# EAGLE design high_power_motorshield_v1 (EAGLE 6.5.0)
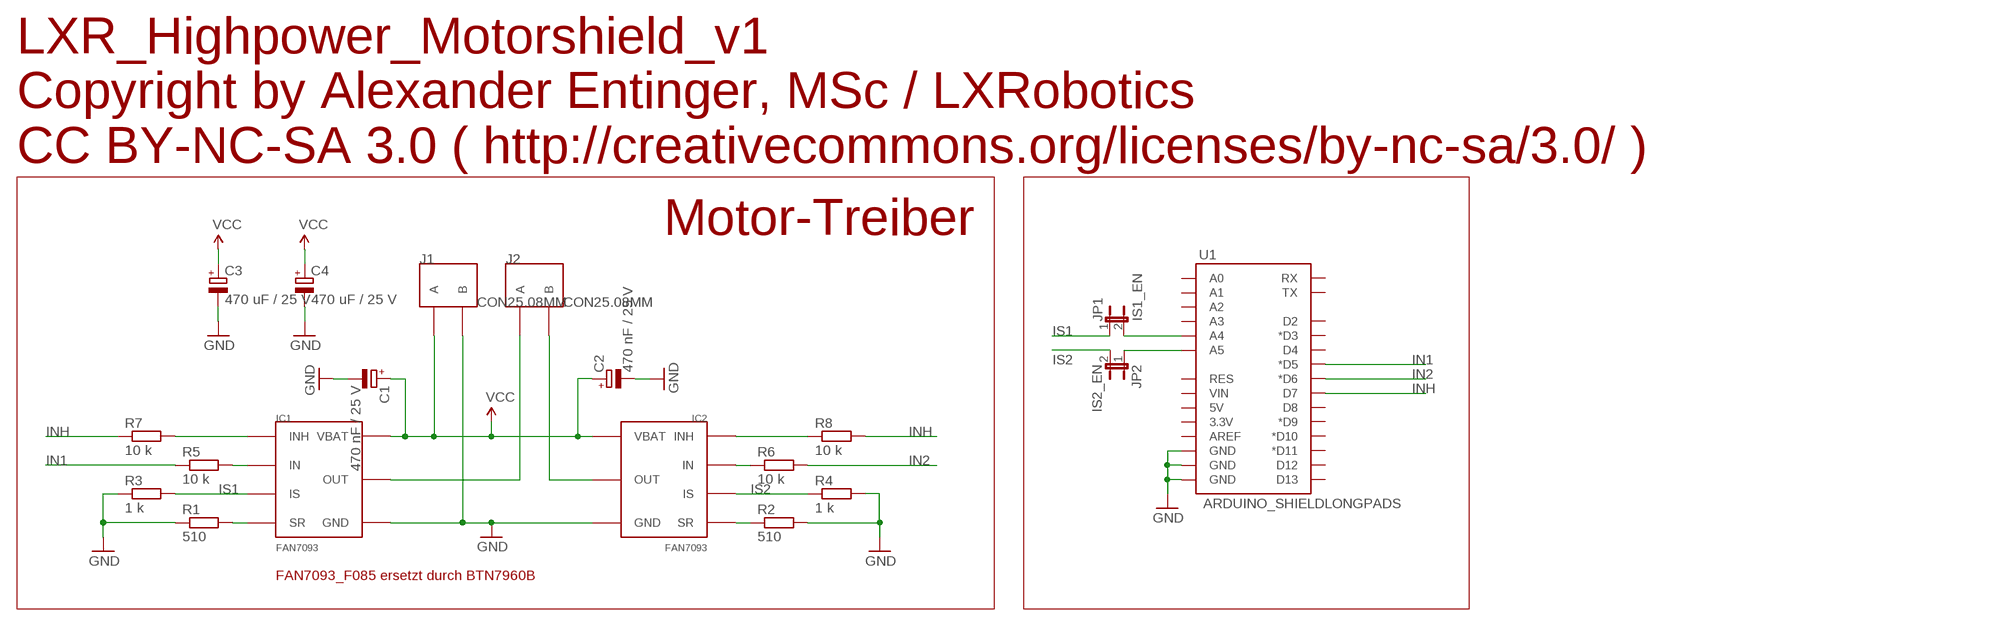
[diagram p0: schematic, sheet 1]

## Parts
C1  470 nF / 25 V  CPOL-EU  [KEMET_A]
C2  470 nF / 25 V  CPOL-EU  [KEMET_A]
C3  470 uF / 25 V  CPOL-EUE5-10.5  [E5-10,5]
C4  470 uF / 25 V  CPOL-EUE5-10.5  [E5-10,5]
IC1  FAN7093  [TO263-7L]
IC2  FAN7093  [TO263-7L]
J1  CON25.08MM  [CON2_SCHRAUBKLEMME]
J2  CON25.08MM  [CON2_SCHRAUBKLEMME]
JP1  IS1_EN  JP1E  [JP1]
JP2  IS2_EN  JP1E  [JP1]
R1  510  R-EU_R0805  [R0805]
R2  510  R-EU_R0805  [R0805]
R3  1 k  R-EU_R0805  [R0805]
R4  1 k  R-EU_R0805  [R0805]
R5  10 k  R-EU_R0805  [R0805]
R6  10 k  R-EU_R0805  [R0805]
R7  10 k  R-EU_R0805  [R0805]
R8  10 k  R-EU_R0805  [R0805]
U1  ARDUINO_SHIELDLONGPADS  [DUEMILANOVE_SHIELD_LONGPADS]

## Nets
GND: C1.CATHODE(-) C2.CATHODE(-) C3.- C4.- IC1.GND IC2.GND J1.2(B) R1.1 R2.2 R3.1 R4.2 U1.GND@0(GND) U1.GND@1(GND) U1.GND@2(GND)
IN1: R5.1 U1.D5(*D5)
IN2: R6.2 U1.D6(*D6)
INH: R7.1 R8.2 U1.D7
IS1: IC1.IS JP1.1 R3.2
IS2: IC2.IS JP2.2 R4.1
N$1: IC1.INH R7.2
N$2: IC1.IN R5.2
N$3: IC1.OUT IC1.OUT@1(OUT) J2.1(A)
N$4: IC2.OUT IC2.OUT@1(OUT) J2.2(B)
N$5: JP1.2 U1.A4
N$6: IC1.SR R1.2
N$7: IC2.SR R2.1
N$8: JP2.1 U1.A5
N$9: IC2.IN R6.1
N$10: IC2.INH R8.1
VCC: C1.ANODE(+) C2.ANODE(+) C3.+ C4.+ IC1.VBATT(VBAT) IC2.VBATT(VBAT) J1.1(A)
Unconnected: U1.3.3V U1.5V U1.A0 U1.A1 U1.A2 U1.A3 U1.AREF U1.D2 U1.D3(*D3) U1.D4 U1.D8 U1.D9(*D9) U1.D10(*D10) U1.D11(*D11) U1.D12 U1.D13 U1.RES U1.RX U1.TX U1.VIN

## Notes on the sheet
- LXR_Highpower_Motorshield_v1
  Copyright by Alexander Entinger, MSc / LXRobotics
  CC BY-NC-SA 3.0 ( http://creativecommons.org/licenses/by-nc-sa/3.0/ )
- Motor-Treiber
- FAN7093_F085 ersetzt durch BTN7960B

## Library data of the parts
C1-C4 = lxrobotics:CPOL-EU: POLARIZED CAPACITOR, European symbol
IC1 IC2 = lxrobotics:FAN7093
J1 J2 = lxrobotics:CON2
JP1 JP2 = jumper:JP1E: JUMPER
R1-R8 = resistor:R-EU_: RESISTOR, European symbol
U1 = SparkFun-Boards:ARDUINO_SHIELD: Arduino shield footprint

## Board
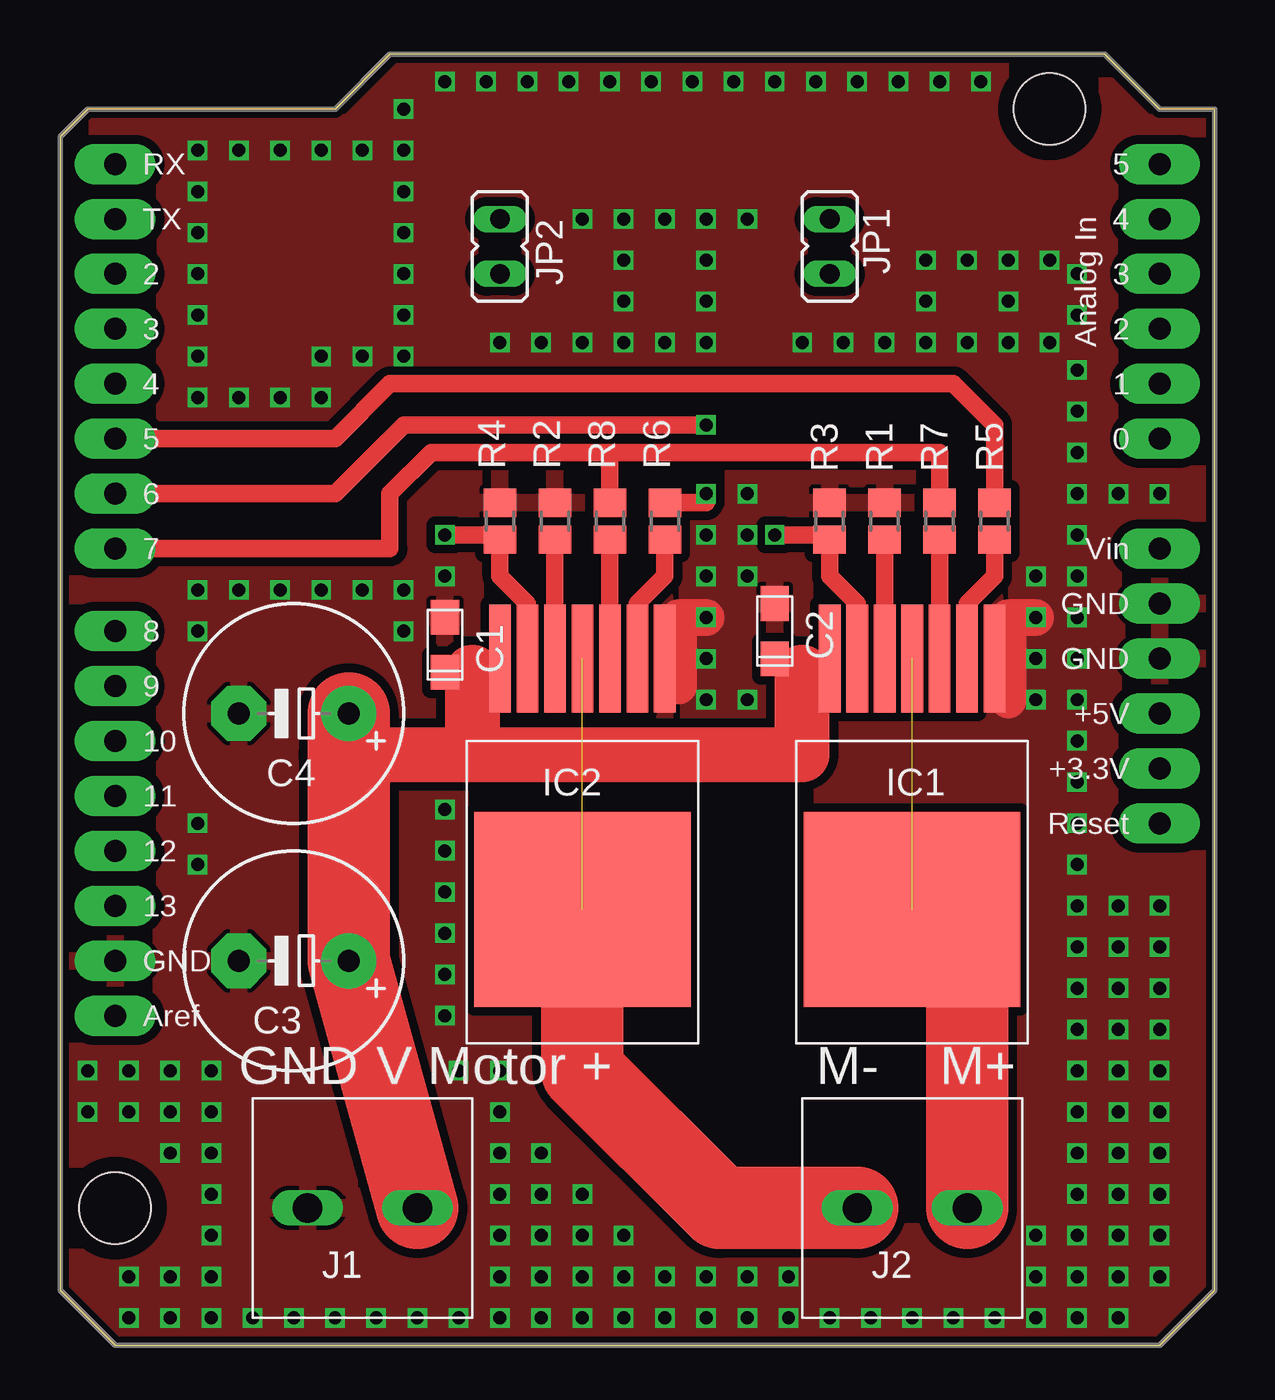
[diagram p1: board, top side]
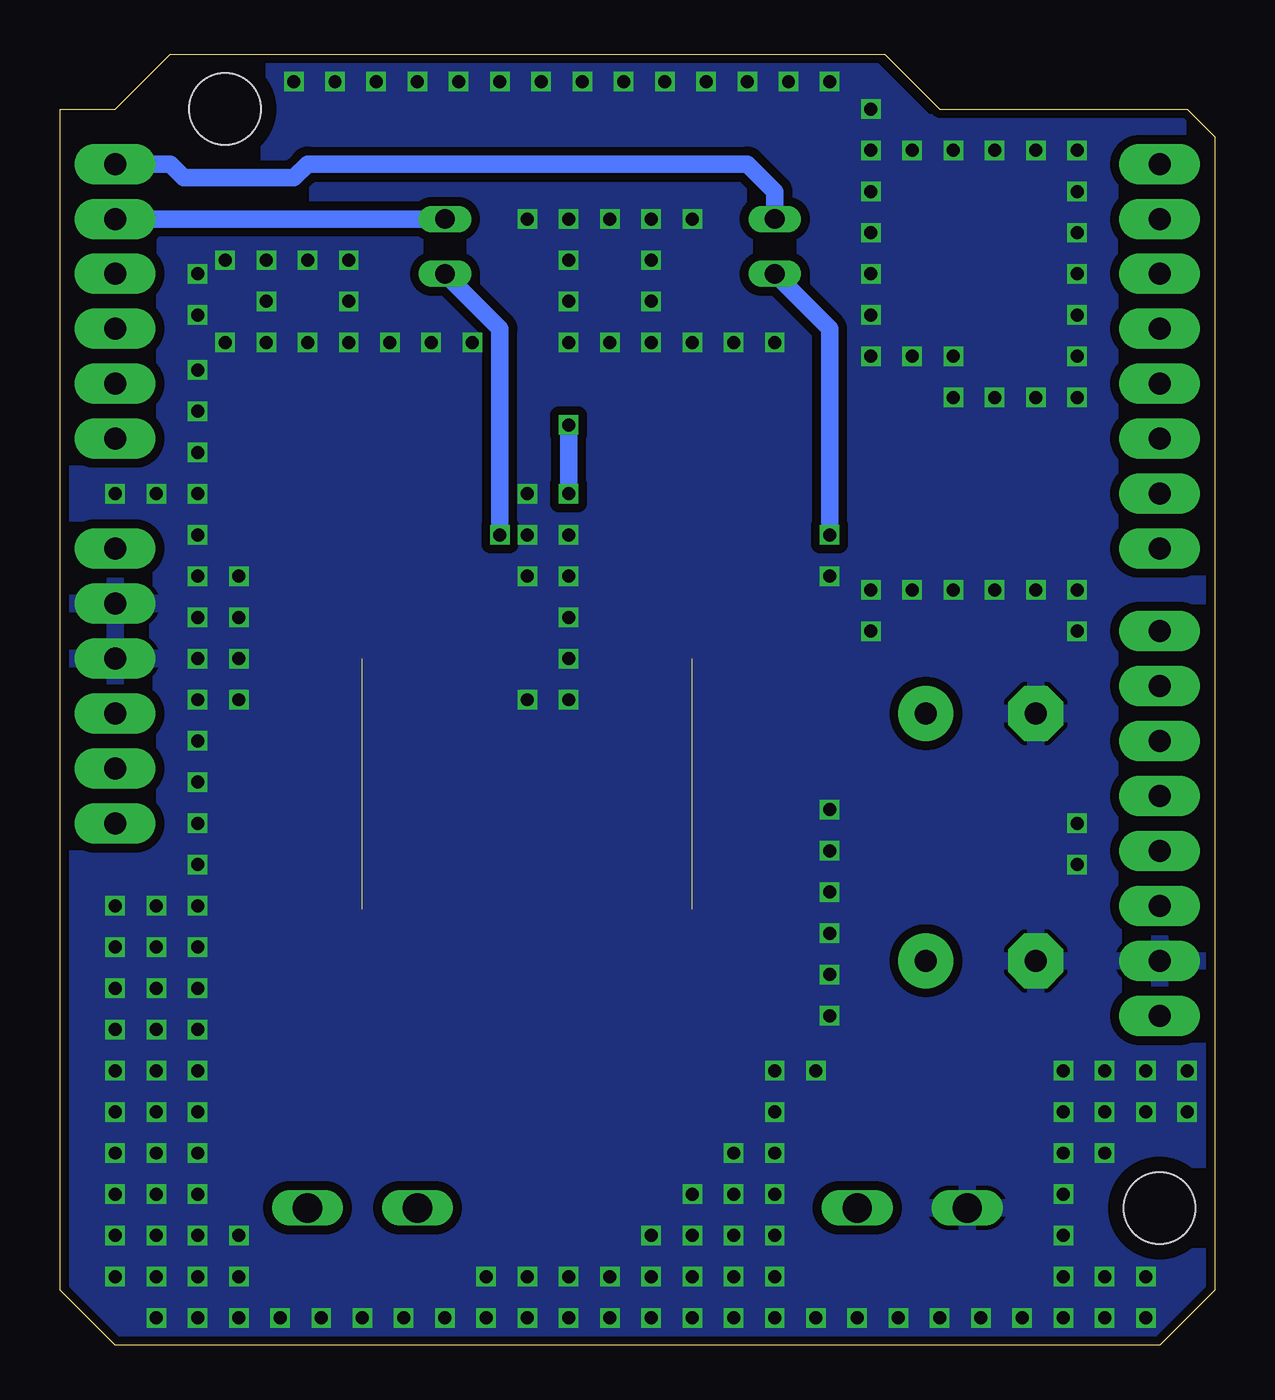
[diagram p2: board, bottom side, seen from below]

Size 53.34 x 59.69 mm. Coordinates in mm from the lower left corner, seen from the top.
Outline: 0,2.54 2.54,0 50.8,0 53.34,2.54 53.34,57.15 50.8,57.15 48.26,59.69 15.24,59.69 12.7,57.15 1.27,57.15 0,55.88 0,2.54
Copper layers (1*16): Top 0.035mm / dielectric 1.5mm / Bottom 0.035mm
Design rules "LeitOn - Standard-Eagle-DRU - 1- und  2-Lagen DK - deutsch - Rev 2.0": minimum track width 0.15mm, minimum drill 0.3mm, track to track 0.15mm, track to pad 0.15mm, pad to pad 0.15mm, via to via 0.15mm, smd to smd 0.15mm, copper to edge 0.3mm, drill to drill 0.3mm, minimum pad ring 0.15mm, minimum via ring 0.15mm, stop-mask expansion 0.075mm, vias tented up to drill 0mil, thermal gap 0.2mm

### Footprints (pad centres in the part's own frame; a part is rotated, then mirrored left to right if it is on the bottom)
KEMET_A = smd 1.6 x 1.3: ANODE 1.275,0; CATHODE -1.275,0
E5-10,5 = drill 1.016 pad 2.54: + -2.54,0 | drill 1.016 pad 2.54 octagon: - 2.54,0
TO263-7L = smd 1 x 5: GND -3.81,0; IN -2.54,0; INH -1.27,0; IS 2.54,0; OUT 0,0; SR 1.27,0; VBATT 3.81,0 | smd 10 x 9: OUT@1 0,11.6
CON2_SCHRAUBKLEMME = drill 1.35 long: 1 -2.54,0; 2 2.54,0
JP1 = drill 0.914 long: 1 0,-1.27; 2 0,1.27
R0805 = smd 1.3 x 1.5: 1 -0.85,0; 2 0.85,0
DUEMILANOVE_SHIELD_LONGPADS = drill 1.016 pad 1.88 long: 3.3V 50.8,26.67; 5V 50.8,29.21; A0 50.8,41.91; A1 50.8,44.45; A2 50.8,46.99; A3 50.8,49.53; A4 50.8,52.07; A5 50.8,54.61; AREF 2.54,15.24; D2 2.54,49.53; D3 2.54,46.99; D4 2.54,44.45; D5 2.54,41.91; D6 2.54,39.37; D7 2.54,36.83; D8 2.54,33.02; D9 2.54,30.48; D10 2.54,27.94; D11 2.54,25.4; D12 2.54,22.86; D13 2.54,20.32; GND@0 50.8,31.75; GND@1 50.8,34.29; GND@2 2.54,17.78; RES 50.8,24.13; RX 2.54,54.61; TX 2.54,52.07; VIN 50.8,36.83 | hole 3.302: 45.72,57.15; 2.54,6.35

### Placement (x,y rotation side)
C1  17.78,32.39 270 top
C2  33.02,33.02 270 top
C3  10.79,17.78 180 top
C4  10.79,29.21 180 top
IC1  39.37,31.75 180 top
IC2  24.13,31.75 180 top
J1  13.97,6.35 180 top
J2  39.37,6.35 180 top
JP1  35.56,50.8 0 top
JP2  20.32,50.8 180 top
R1  38.1,38.1 270 top
R2  22.86,38.1 90 top
R3  35.56,38.1 270 top
R4  20.32,38.1 90 top
R5  43.18,38.1 270 top
R6  27.94,38.1 90 top
R7  40.64,38.1 270 top
R8  25.4,38.1 90 top
U1  0,0 0 top

### Tracks (layer width: path | path; a pad name or v marks a point on that pad's centre or on a via)
GND  (via drill 0.6)
  Top 1.676: v29.84,33.66 28.58,33.66 28.58,30.48 | v45.09,33.66 43.81,33.66 43.81,29.85
  other vias: 31.75,39.37 31.75,37.47 46.99,41.28 31.75,35.56 29.84,37.47 29.84,35.56 29.84,31.75 29.84,29.85 31.75,29.85 45.09,31.75 45.09,29.85 46.99,27.94 46.99,29.85 46.99,31.75 46.99,33.66 46.99,35.56 46.99,37.47 46.99,39.37 45.09,35.56 6.35,34.92 8.26,34.92 6.35,33.02 10.16,34.92 12.06,34.92 13.97,34.92 15.87,34.92 15.87,33.02 17.78,35.56 48.9,39.37 50.8,39.37 46.99,26.04 46.99,24.13 46.99,22.22 50.8,20.32 48.9,20.32 46.99,20.32 46.99,18.41 48.9,18.41 50.8,18.41 46.99,16.51 48.9,16.51 50.8,16.51 50.8,14.61 48.9,14.61 46.99,14.61 50.8,12.7 48.9,12.7 46.99,12.7 50.8,10.8 48.9,8.89 48.9,10.8 46.99,10.8 46.99,8.89 50.8,8.89 50.8,6.98 48.9,6.98 46.99,6.98 46.99,5.08 48.9,5.08 50.8,5.08 50.8,3.18 48.9,3.18 46.99,3.18 46.99,1.27 48.9,1.27 45.09,5.08 1.27,12.7 3.17,12.7 5.08,12.7 6.98,12.7 1.27,10.8 3.17,10.8 5.08,10.8 6.98,10.8 6.98,8.89 5.08,8.89 6.98,6.98 6.98,5.08 3.17,3.18 5.08,3.18 6.98,3.18 18.41,12.7 20.32,12.7 20.32,10.8 20.32,8.89 22.23,8.89 20.32,6.98 22.23,6.98 24.13,6.98 20.32,5.08 22.23,5.08 24.13,5.08 26.04,5.08 20.32,3.18 22.23,3.18 24.13,3.18 26.04,3.18 27.94,3.18 29.84,3.18 31.75,3.18 33.66,3.18 3.17,1.27 5.08,1.27 6.98,1.27 8.89,1.27 10.79,1.27 12.7,1.27 14.6,1.27 16.51,1.27 18.41,1.27 20.32,1.27 22.23,1.27 24.13,1.27 26.04,1.27 27.94,1.27 29.84,1.27 31.75,1.27 33.66,1.27 35.56,1.27 37.47,1.27 39.37,1.27 41.27,1.27 43.18,1.27 45.09,1.27 45.09,3.18 6.35,24.13 6.35,22.22 17.78,24.77 17.78,22.86 17.78,20.96 17.78,19.05 17.78,17.14 17.78,15.24 42.55,58.42 40.64,58.42 38.73,58.42 36.83,58.42 34.93,58.42 33.02,58.42 31.12,58.42 29.21,58.42 27.3,58.42 25.4,58.42 23.5,58.42 21.59,58.42 19.69,58.42 17.78,58.42 24.13,52.07 26.04,52.07 27.94,52.07 29.84,52.07 31.75,52.07 29.84,46.36 27.94,46.36 26.04,46.36 24.13,46.36 22.23,46.36 20.32,46.36 26.04,50.17 26.04,48.26 29.84,50.17 29.84,48.26 34.29,46.36 41.91,50.17 40.01,50.17 40.01,48.26 36.2,46.36 38.1,46.36 40.01,46.36 41.91,46.36 43.81,46.36 46.99,43.18 46.99,45.08 46.99,47.62 45.72,46.36 43.81,48.26 46.99,49.53 45.72,50.17 43.81,50.17 15.87,57.15 15.87,55.24 15.87,53.34 15.87,51.44 15.87,49.53 15.87,47.62 15.87,45.72 13.97,45.72 12.06,45.72 12.06,43.81 10.16,43.81 8.26,43.81 6.35,43.81 6.35,45.72 6.35,47.62 6.35,49.53 6.35,51.44 6.35,53.34 6.35,55.24 8.26,55.24 10.16,55.24 12.06,55.24 13.97,55.24
  pour Bottom (isolate 0.406): 0.63,2.54 2.54,0.64 50.8,0.64 52.7,2.54 52.7,56.52 50.17,56.52 47.62,59.05 15.87,59.05 13.33,56.52 1.27,56.52 0.63,55.88
  pour Top (isolate 0.406): 0.63,2.54 2.54,0.64 50.8,0.64 52.7,2.54 52.7,56.52 50.8,56.52 50.17,56.52 47.62,59.05 15.87,59.05 13.33,56.52 1.27,56.52 0.63,55.88
IN1
  Top 0.813: U1.D5 12.7,41.91 15.24,44.45 41.27,44.45 43.18,42.55 R5.1
IN2  (via drill 0.6)
  Top 0.813: R6.2 29.84,38.95 v29.84,39.37 | v29.84,42.55 15.87,42.55 12.7,39.37 U1.D6
  Bottom 0.813: v29.84,39.37 v29.84,42.55
INH
  Top 0.813: U1.D7 15.24,36.83 15.24,39.37 17.14,41.28 25.4,41.28 | 25.4,41.28 R8.2 | R7.1 40.64,41.28 25.4,41.28
IS1  (via drill 0.6)
  Top 0.813: v33.02,37.47 35.56,37.47 R3.2 35.56,35.56 36.83,34.29 IC1.IS
  Bottom 0.813: v33.02,37.47 33.02,46.99 JP1.1
IS2  (via drill 0.6)
  Top 0.813: IC2.IS 21.59,34.29 20.32,35.56 20.32,36.2 R4.1 20.32,37.47 v17.78,37.47
  Bottom 0.813: v17.78,37.47 17.78,46.99 JP2.2
N$1
  Top 0.813: IC1.INH 40.64,36.83 R7.2 40.64,37.47
N$2
  Top 0.813: IC1.IN 41.91,34.29 43.18,35.56 R5.2 43.18,37.47
N$3  (1 unrouted)
  Top 3.81: J2.1 41.91,17.61 IC1.OUT@1
N$4  (1 unrouted)
  Top 3.81: J2.2 30.48,6.35 24.13,12.7 IC2.OUT@1
N$5
  Bottom 0.813: JP1.2 U1.A4
N$6
  Top 0.813: IC1.SR 38.1,36.83 R1.2 38.1,37.47
N$7
  Top 0.813: IC2.SR R2.1 22.86,37.47
N$8
  Bottom 0.813: JP2.1 20.32,53.34 21.59,54.61 41.91,54.61 42.55,53.97 47.62,53.97 48.26,54.61 U1.A5
N$9
  Top 0.813: IC2.IN 26.67,34.29 27.94,35.56 27.94,36.83 R6.1 27.94,37.47
N$10
  Top 0.813: IC2.INH R8.1 25.4,37.47
VCC
  Top 0.813: C1.ANODE 19.05,31.11 19.05,31.75 IC2.VBATT | C2.ANODE 34.29,31.75 | 34.29,31.75 34.29,31.11 | IC1.VBATT 34.29,31.75
  Top 2.54: 13.33,27.31 19.05,27.31 | 19.05,31.11 19.05,27.31 | 19.05,27.31 34.29,27.31 34.29,31.11
  Top 3.81: J1.1 C3.+ 13.33,27.31 C4.+

### Text on the board
tNames: GND | V Motor + | M- | M+